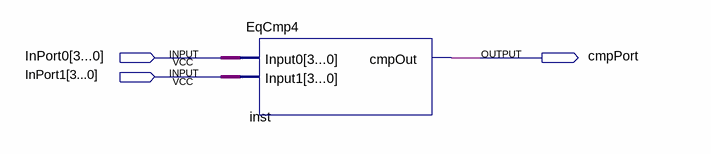
[diagram p0: schematic sheet]
// Quartus schematic EqCmpDemo.bdf as structural Verilog: 1 symbols, 3 pins
module EqCmpDemo (
  input  \InPort0[3...0] ,
  input  \InPort1[3...0] ,
  output cmpPort
);

  EqCmp4 inst (.\Input0[3...0] (\InPort0[3...0] ), .\Input1[3...0] (\InPort1[3...0] ), .cmpOut(cmpPort));
endmodule
